# Altium schematic sheet ADC_Array.SchDoc: 16-Channel 12-bit 4.096V ADC Array with SMA Interfaces
size A4; DocumentNumber: 12; SheetNumber: 12; SheetTotal: 16
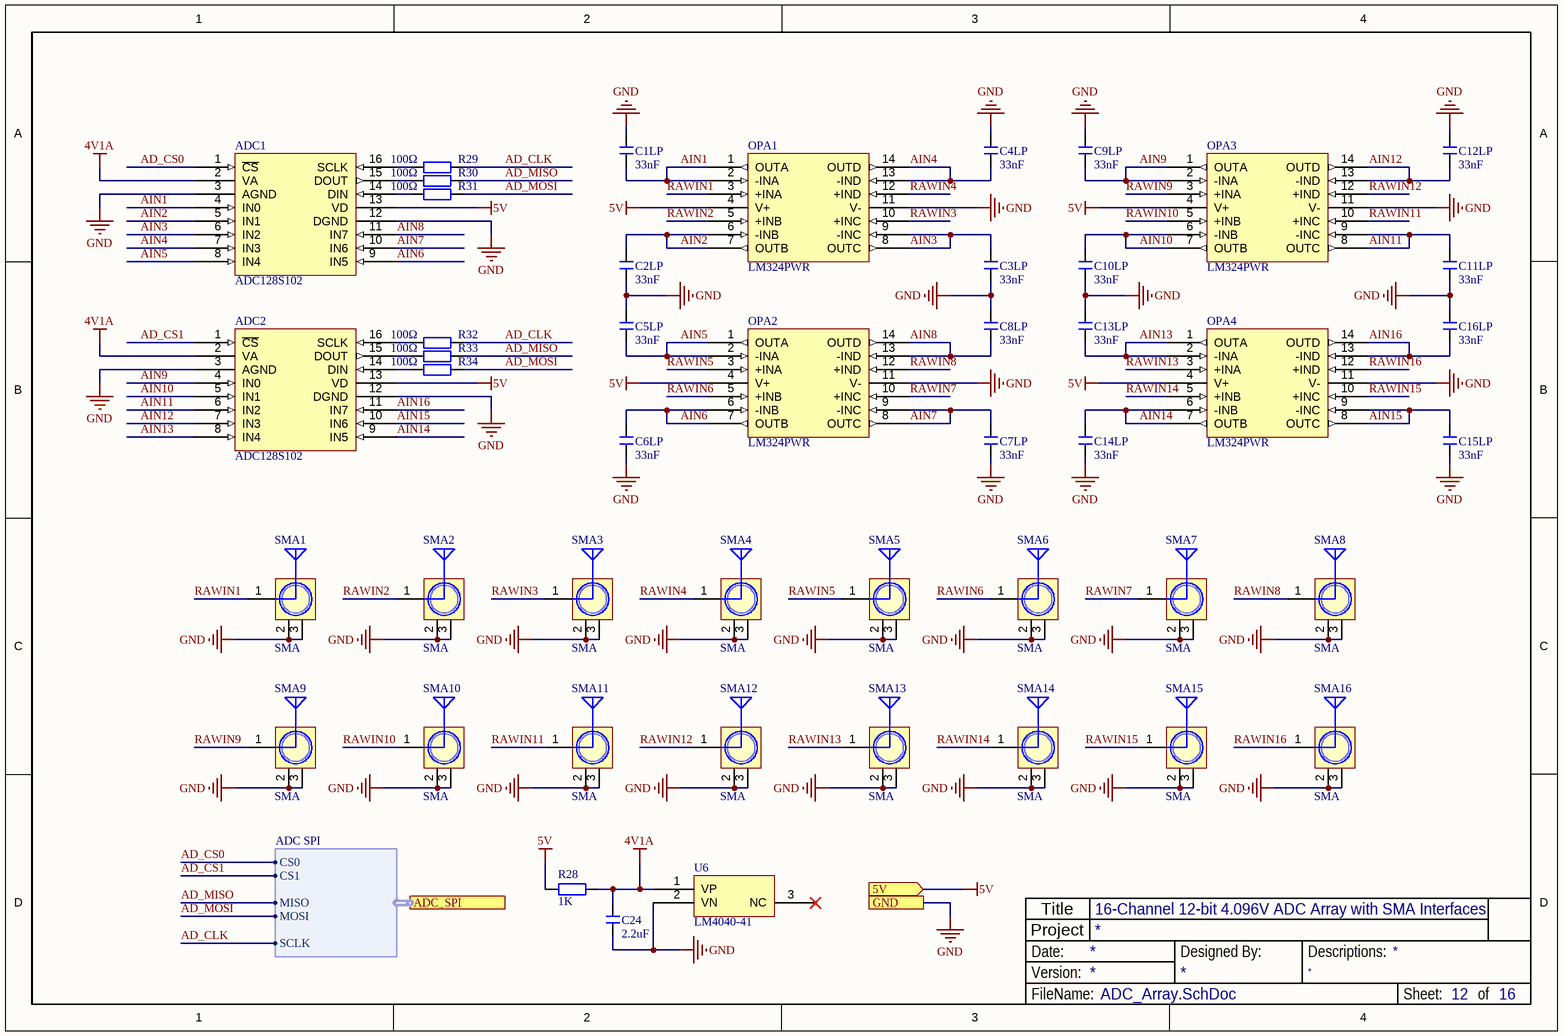
[diagram p0: ADC_Array.SchDoc]

## Parts
ADC1  ADC128S102  [TSSOP16_N]
ADC2  ADC128S102  [TSSOP16_N]
C1LP  33nF  [C 0402_L]
C2LP  33nF  [C 0402_L]
C3LP  33nF  [C 0402_L]
C4LP  33nF  [C 0402_L]
C5LP  33nF  [C 0402_L]
C6LP  33nF  [C 0402_L]
C7LP  33nF  [C 0402_L]
C8LP  33nF  [C 0402_L]
C9LP  33nF  [C 0402_L]
C10LP  33nF  [C 0402_L]
C11LP  33nF  [C 0402_L]
C12LP  33nF  [C 0402_L]
C13LP  33nF  [C 0402_L]
C14LP  33nF  [C 0402_L]
C15LP  33nF  [C 0402_L]
C16LP  33nF  [C 0402_L]
C24  2.2uF  [C 0805_L]
OPA1  LM324PWR  [TSSOP-14]
OPA2  LM324PWR  [TSSOP-14]
OPA3  LM324PWR  [TSSOP-14]
OPA4  LM324PWR  [TSSOP-14]
R28  1K  [R 0805_L]
R29  100Ω  [R 0603_L]
R30  100Ω  [R 0603_L]
R31  100Ω  [R 0603_L]
R32  100Ω  [R 0603_L]
R33  100Ω  [R 0603_L]
R34  100Ω  [R 0603_L]
SMA1  SMA  [SMA_FR]
SMA2  SMA  [SMA_FR]
SMA3  SMA  [SMA_FR]
SMA4  SMA  [SMA_FR]
SMA5  SMA  [SMA_FR]
SMA6  SMA  [SMA_FR]
SMA7  SMA  [SMA_FR]
SMA8  SMA  [SMA_FR]
SMA9  SMA  [SMA_FR]
SMA10  SMA  [SMA_FR]
SMA11  SMA  [SMA_FR]
SMA12  SMA  [SMA_FR]
SMA13  SMA  [SMA_FR]
SMA14  SMA  [SMA_FR]
SMA15  SMA  [SMA_FR]
SMA16  SMA  [SMA_FR]
U6  LM4040-41  [SOT23-3]

## Ports
5V (in), ADC_SPI (harness ADC SPI), GND

## Harnesses
ADC SPI: CS0, CS1, MISO, MOSI, SCLK

## Nets
4V1A: ADC1.2(VA) ADC2.2(VA) C24.1 R28.2 U6.1(VP)
5V: ADC1.13(VD) ADC2.13(VD) OPA1.4(V+) OPA2.4(V+) OPA3.4(V+) OPA4.4(V+) R28.1 ; port 5V
GND: ADC1.3(AGND) ADC1.12(DGND) ADC2.3(AGND) ADC2.12(DGND) C1LP.2 C2LP.1 C3LP.1 C4LP.2 C5LP.2 C6LP.1 C7LP.1 C8LP.2 C9LP.2 C10LP.1 C11LP.1 C12LP.2 C13LP.2 C14LP.1 C15LP.1 C16LP.2 C24.2 OPA1.11(V-) OPA2.11(V-) OPA3.11(V-) OPA4.11(V-) SMA1.2(GND) SMA1.3(GND) SMA2.2(GND) SMA2.3(GND) SMA3.2(GND) SMA3.3(GND) SMA4.2(GND) SMA4.3(GND) SMA5.2(GND) SMA5.3(GND) SMA6.2(GND) SMA6.3(GND) SMA7.2(GND) SMA7.3(GND) SMA8.2(GND) SMA8.3(GND) SMA9.2(GND) SMA9.3(GND) SMA10.2(GND) SMA10.3(GND) SMA11.2(GND) SMA11.3(GND) SMA12.2(GND) SMA12.3(GND) SMA13.2(GND) SMA13.3(GND) SMA14.2(GND) SMA14.3(GND) SMA15.2(GND) SMA15.3(GND) SMA16.2(GND) SMA16.3(GND) U6.2(VN) ; port GND
AD_CLK: R29.2 R32.2 ; port ADC_SPI.SCLK
AD_CS0: ADC1.1(~{CS}) ; port ADC_SPI.CS0
AD_CS1: ADC2.1(~{CS}) ; port ADC_SPI.CS1
AD_MISO: R30.2 R33.2 ; port ADC_SPI.MISO
AD_MOSI: R31.2 R34.2 ; port ADC_SPI.MOSI
AIN1: ADC1.4(IN0) C1LP.1 OPA1.1(OUTA) OPA1.2(-INA)
AIN2: ADC1.5(IN1) C2LP.2 OPA1.6(-INB) OPA1.7(OUTB)
AIN3: ADC1.6(IN2) C3LP.2 OPA1.8(OUTC) OPA1.9(-INC)
AIN4: ADC1.7(IN3) C4LP.1 OPA1.13(-IND) OPA1.14(OUTD)
AIN5: ADC1.8(IN4) C5LP.1 OPA2.1(OUTA) OPA2.2(-INA)
AIN6: ADC1.9(IN5) C6LP.2 OPA2.6(-INB) OPA2.7(OUTB)
AIN7: ADC1.10(IN6) C7LP.2 OPA2.8(OUTC) OPA2.9(-INC)
AIN8: ADC1.11(IN7) C8LP.1 OPA2.13(-IND) OPA2.14(OUTD)
AIN9: ADC2.4(IN0) C9LP.1 OPA3.1(OUTA) OPA3.2(-INA)
AIN10: ADC2.5(IN1) C10LP.2 OPA3.6(-INB) OPA3.7(OUTB)
AIN11: ADC2.6(IN2) C11LP.2 OPA3.8(OUTC) OPA3.9(-INC)
AIN12: ADC2.7(IN3) C12LP.1 OPA3.13(-IND) OPA3.14(OUTD)
AIN13: ADC2.8(IN4) C13LP.1 OPA4.1(OUTA) OPA4.2(-INA)
AIN14: ADC2.9(IN5) C14LP.2 OPA4.6(-INB) OPA4.7(OUTB)
AIN15: ADC2.10(IN6) C15LP.2 OPA4.8(OUTC) OPA4.9(-INC)
AIN16: ADC2.11(IN7) C16LP.1 OPA4.13(-IND) OPA4.14(OUTD)
RAWIN1: OPA1.3(+INA) SMA1.1(ANT)
RAWIN2: OPA1.5(+INB) SMA2.1(ANT)
RAWIN3: OPA1.10(+INC) SMA3.1(ANT)
RAWIN4: OPA1.12(+IND) SMA4.1(ANT)
RAWIN5: OPA2.3(+INA) SMA5.1(ANT)
RAWIN6: OPA2.5(+INB) SMA6.1(ANT)
RAWIN7: OPA2.10(+INC) SMA7.1(ANT)
RAWIN8: OPA2.12(+IND) SMA8.1(ANT)
RAWIN9: OPA3.3(+INA) SMA9.1(ANT)
RAWIN10: OPA3.5(+INB) SMA10.1(ANT)
RAWIN11: OPA3.10(+INC) SMA11.1(ANT)
RAWIN12: OPA3.12(+IND) SMA12.1(ANT)
RAWIN13: OPA4.3(+INA) SMA13.1(ANT)
RAWIN14: OPA4.5(+INB) SMA14.1(ANT)
RAWIN15: OPA4.10(+INC) SMA15.1(ANT)
RAWIN16: OPA4.12(+IND) SMA16.1(ANT)
NetADC1_14: ADC1.14(DIN) R31.1
NetADC1_15: ADC1.15(DOUT) R30.1
NetADC1_16: ADC1.16(SCLK) R29.1
NetADC2_14: ADC2.14(DIN) R34.1
NetADC2_15: ADC2.15(DOUT) R33.1
NetADC2_16: ADC2.16(SCLK) R32.1

Not connected (* = marked no-connect by the designer): U6 3(NC)*

## Notes on the sheet
- Title
- FileName:
- Version:
- Date:
- Project
- Designed By:
- Descriptions:
- Sheet:
- of

## Library data of the parts
ADC1 ADC2 = ADC128S102: TI 12-bit Oct-channel ADC / C179666
C1LP C2LP C3LP C4LP C5LP C6LP C7LP C8LP C9LP C10LP C11LP C12LP C13LP C14LP C15LP C16LP C24 = C: 贴片电容; BOM名称: 无极性贴片电容; 淘宝ID: 封装库来自淘宝 ID：黄晶宝石; 联系售后，技术支持: https://shop463601444.taobao.com; 唯一出售店铺网址: https://shop463601444.taobao.com
OPA1-OPA4 = OPA4197IPWR: Quad-channel Operational Amplifier
R28 = R: 贴片电阻 / *LCID: C2907295; 版权归属: 来自淘宝 ID：黄晶宝石; 封装库来自淘宝卖家 ID：黄晶宝石: 其他店铺购入均为盗版，不享受售后技术支持服务，请立即申请退款; BOM名称: 贴片电阻; 联系售后: https://shop463601444.taobao.com
R29-R34 = R: 贴片电阻; 版权归属: 来自淘宝 ID：黄晶宝石; 封装库来自淘宝卖家 ID：黄晶宝石: 其他店铺购入均为盗版，不享受售后技术支持服务，请立即申请退款; BOM名称: 贴片电阻; 联系售后: https://shop463601444.taobao.com
SMA1-SMA16 = SMA: SMA-2.4G射频天线接口; 版权归属: 封装库来自淘宝 ID：黄晶宝石; BOM名称: SMA-2.4G射频天线接口; 学习资源: https://shop463601444.taobao.com
U6 = LM4040: Shunt Voltage Reference 4.096V